# EAGLE schematic Opdracht3 (EAGLE 9.5.2)
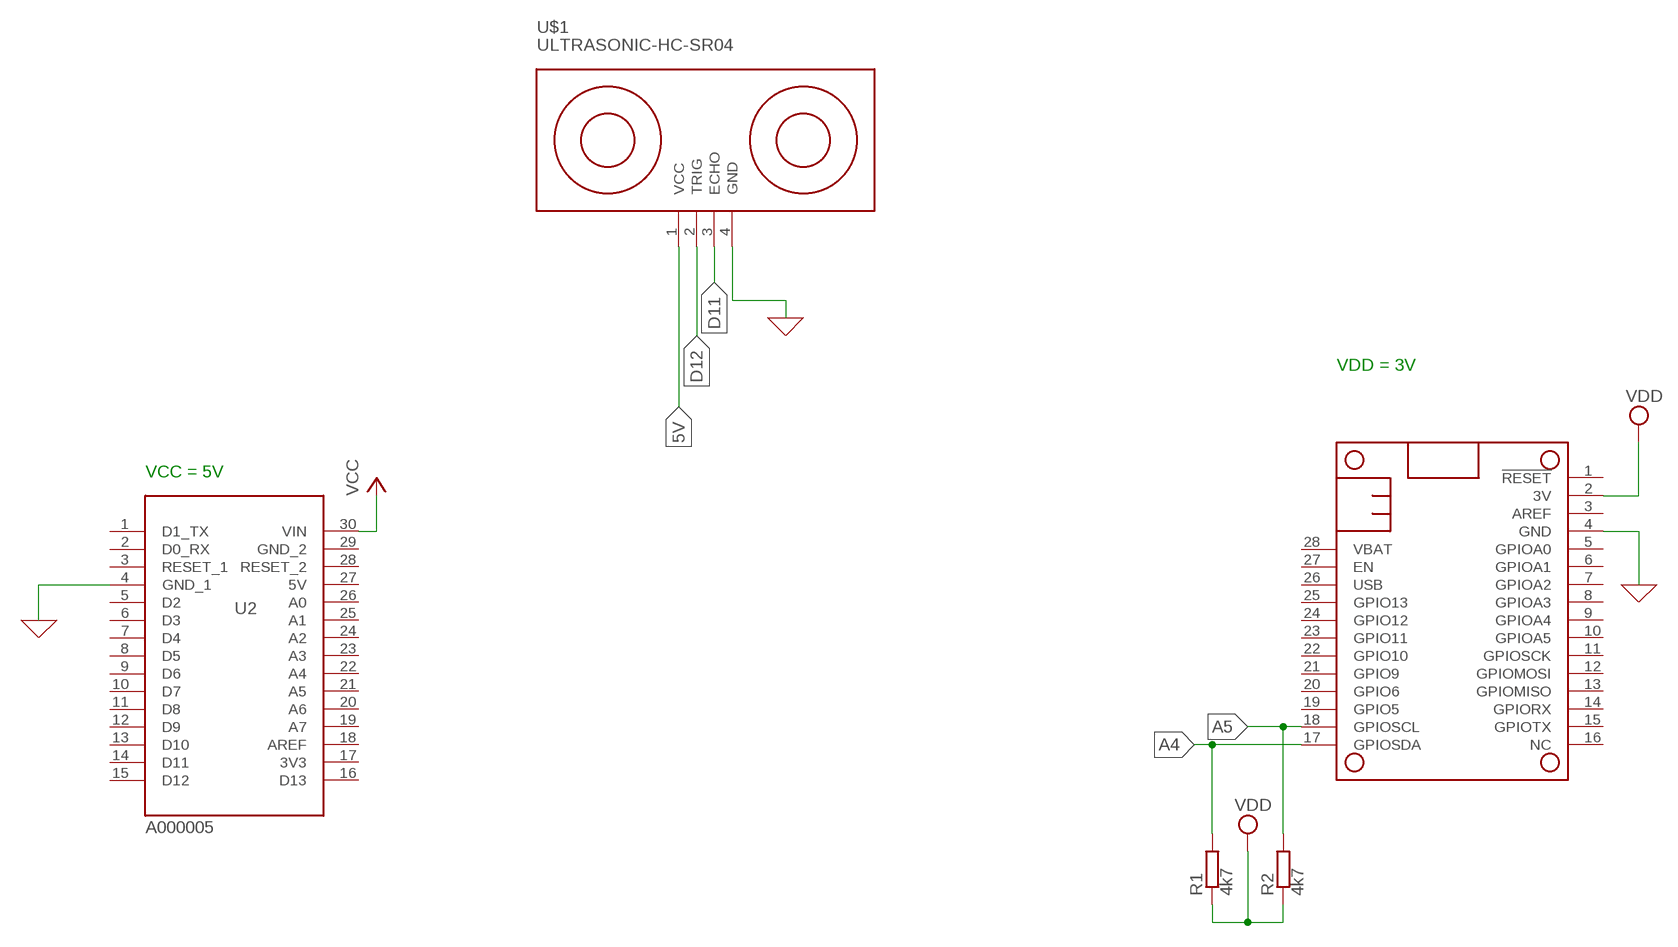
[diagram p0: schematic, sheet 1]

## Parts
MS1  FEATHERWING  [FEATHERWING]
R1  4k7  SMT-REF  [SMT-REF]
R2  4k7  SMT-REF  [SMT-REF]
U2  A000005  [ARDUINO_A000005]
U$1  ULTRASONIC-HC-SR04  [ULTRASONIC-HC-SR04]

## Nets
0: MS1.4(GND) U2.4(GND_1) U$1.4(GND) ; supply symbol labelled GND
5V: U$1.1(VCC)
A4: MS1.17(GPIOSDA) R1.1
A5: MS1.18(GPIOSCL) R2.1
D11: U$1.3(ECHO)
D12: U$1.2(TRIG)
VCC: U2.30(VIN)
VDD: MS1.2(3V) R1.2 R2.2
Unconnected: MS1.1(!RESET) MS1.3(AREF) MS1.5(GPIOA0) MS1.6(GPIOA1) MS1.7(GPIOA2) MS1.8(GPIOA3) MS1.9(GPIOA4) MS1.10(GPIOA5) MS1.11(GPIOSCK) MS1.12(GPIOMOSI) MS1.13(GPIOMISO) MS1.14(GPIORX) MS1.15(GPIOTX) MS1.16(NC) MS1.19(GPIO5) MS1.20(GPIO6) MS1.21(GPIO9) MS1.22(GPIO10) MS1.23(GPIO11) MS1.24(GPIO12) MS1.25(GPIO13) MS1.26(USB) MS1.27(EN) MS1.28(VBAT) U2.1(D1_TX) U2.2(D0_RX) U2.3(RESET_1) U2.5(D2) U2.6(D3) U2.7(D4) U2.8(D5) U2.9(D6) U2.10(D7) U2.11(D8) U2.12(D9) U2.13(D10) U2.14(D11) U2.15(D12) U2.16(D13) U2.17(3V3) U2.18(AREF) U2.19(A7) U2.20(A6) U2.21(A5) U2.22(A4) U2.23(A3) U2.24(A2) U2.25(A1) U2.26(A0) U2.28(RESET_2)

## Notes on the sheet
- VDD = 3V
- VCC = 5V

## Power pins joined to a net without a drawn wire
5V: U2.27(5V)
GND_2: U2.29(GND_2)

## Library data of the parts
MS1 = adafruit:FEATHERWING
R1 R2 = resistor-shunt:SMT-REF: SMD SHUNT RESISTOR; OC_FARNELL: unknown; OC_NEWARK: unknown
U2 = A000005:A000005: MICRO, ARDUINO NANO 3.0, MINI-B USB, ATmega328, 0.1"DIP, ICSP HDR; AVAILABILITY: Unavailable; DESCRIPTION: CLOCK SAW OSCILLATOR SEAM7050 T&; MF: Arduino; MP: A000005; PACKAGE: None; PRICE: None
U$1 = diy-modules:ULTRASONIC-HC-SR04: Ultrasonic Ranging Module HC-SR04 More details available here: http://randomnerdtutorials.com/complete-guide-for-ultrasonic-sensor-hc-sr04/ Click here to find device on ebay.com <http://www.ebay.com/sch/hc+sr04+ultrasonic>